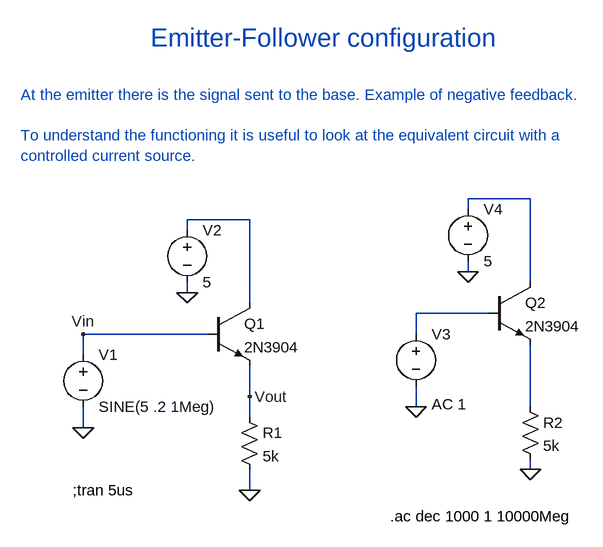
[diagram p0: schematic BJT-emitter-follower-configuration.asc]
BJT-emitter-follower-configuration.asc, the LTspice schematic file:
Version 4.1
SHEET 1 880 680
WIRE -432 -32 -528 -32
WIRE -528 -16 -528 -32
WIRE -864 0 -960 0
WIRE -960 16 -960 0
WIRE -528 80 -528 64
WIRE -432 96 -432 -32
WIRE -960 112 -960 96
WIRE -864 128 -864 0
WIRE -496 144 -608 144
WIRE -928 176 -1120 176
WIRE -608 176 -608 144
WIRE -1120 208 -1120 176
WIRE -864 272 -864 224
WIRE -608 288 -608 256
WIRE -432 288 -432 192
WIRE -864 304 -864 272
WIRE -1120 320 -1120 288
WIRE -432 384 -432 368
WIRE -864 416 -864 384
FLAG -864 416 0
FLAG -1120 320 0
FLAG -960 112 0
FLAG -432 384 0
FLAG -608 288 0
FLAG -528 80 0
FLAG -1120 176 Vin
FLAG -864 272 Vout
SYMBOL npn -928 128 R0
SYMATTR InstName Q1
SYMATTR Value 2N3904
SYMBOL res -880 288 R0
SYMATTR InstName R1
SYMATTR Value 5k
SYMBOL voltage -1120 192 R0
WINDOW 123 0 0 Left 2
WINDOW 39 0 0 Left 2
SYMATTR InstName V1
SYMATTR Value SINE(5 .2 1Meg)
SYMBOL voltage -960 0 R0
WINDOW 123 0 0 Left 2
WINDOW 39 0 0 Left 2
SYMATTR InstName V2
SYMATTR Value 5
SYMBOL npn -496 96 R0
SYMATTR InstName Q2
SYMATTR Value 2N3904
SYMBOL res -448 272 R0
SYMATTR InstName R2
SYMATTR Value 5k
SYMBOL voltage -608 160 R0
WINDOW 123 24 124 Left 2
WINDOW 39 0 0 Left 2
SYMATTR Value2 AC 1
SYMATTR InstName V3
SYMATTR Value ""
SYMBOL voltage -528 -32 R0
WINDOW 123 0 0 Left 2
WINDOW 39 0 0 Left 2
SYMATTR InstName V4
SYMATTR Value 5
TEXT -1136 416 Left 2 !;tran 5us
TEXT -648 456 Left 2 !.ac dec 1000 1 10000Meg
TEXT -1216 -192 Left 2 ;At the emitter there is the signal sent to the base. Example of negative feedback.\n \nTo understand the functioning it is useful to look at the equivalent circuit with a\ncontrolled current source.
TEXT -1016 -280 Left 4 ;Emitter-Follower configuration

The netlist it stands for:
* BJT-emitter-follower-configuration.asc
Q1 N002 Vin Vout 0 2N3904
R1 Vout 0 5k
V1 Vin 0 SINE(5 .2 1Meg)
V2 N002 0 5
Q2 N001 N003 N004 0 2N3904
R2 N004 0 5k
V3 N003 0 AC 1
V4 N001 0 5
.model NPN NPN
.model PNP PNP
.lib standard.bjt
;tran 5us
.ac dec 1000 1 10000Meg
* At the emitter there is the signal sent to the base. Example of negative feedback.
* To understand the functioning it is useful to look at the equivalent circuit with a
* controlled current source.
* Emitter-Follower configuration
.backanno
.end